# EAGLE design MIC2260x_Module_Electrolytic (EAGLE 9.6.2)
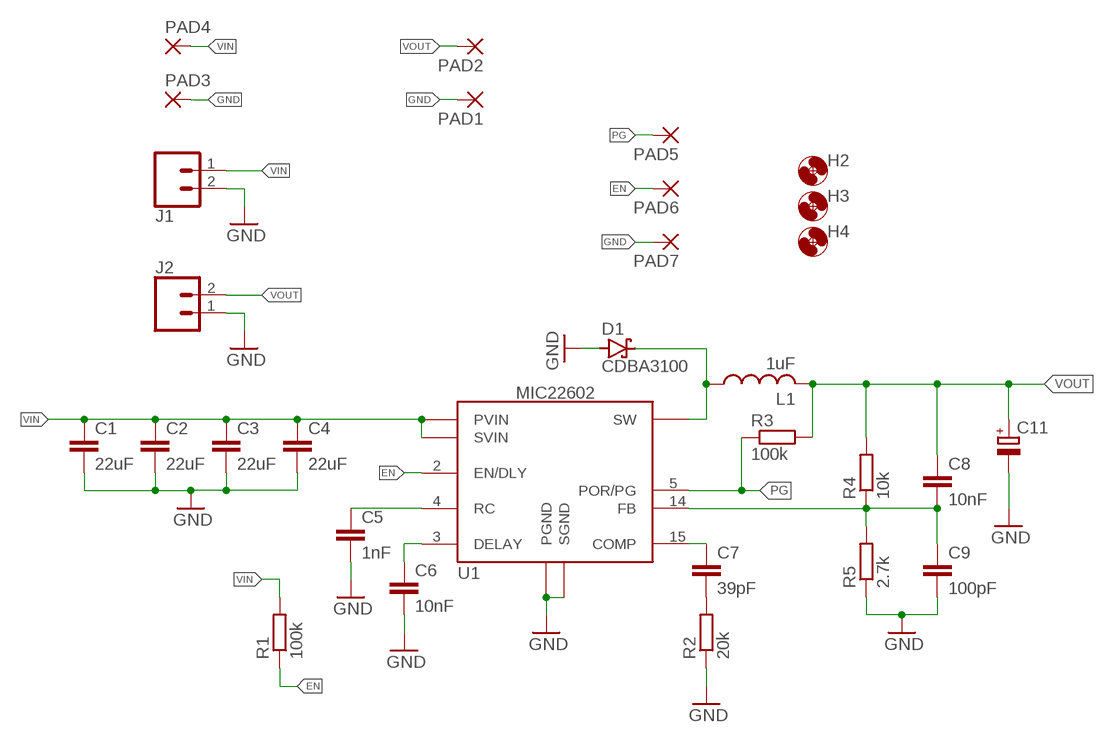
[diagram p0: schematic, sheet 1]

## Parts
C1  22uF  C-EU22UFC0805  [C0805]
C2  22uF  C-EU22UFC0805  [C0805]
C3  22uF  C-EU22UFC0805  [C0805]
C4  22uF  C-EU22UFC0805  [C0805]
C5  1nF  C-EUC0402  [C0402]
C6  10nF  C-EUC0402  [C0402]
C7  39pF  C-EUC0402  [C0402]
C8  10nF  C-EUC0402  [C0402]
C9  100pF  C-EUC0402  [C0402]
C11  CPOL-EUUD-6,3X7,7  [UD-6,3X7,7_NICHICON]
D1  CDBA3100  DIODE_SCHOTTKYDO-214AC  [DO214AC]
H2  MOUNTING_HOLE4_NP  [4_40]
H3  MOUNTING_HOLE4_NP  [4_40]
H4  MOUNTING_HOLE4_NP  [4_40]
J1  CONN_023.5MM_ROUND_RESTRICT  [SCREWTERMINAL-3.5MM-2_ROUND_RESTRICT]
J2  CONN_023.5MM_ROUND_RESTRICT  [SCREWTERMINAL-3.5MM-2_ROUND_RESTRICT]
L1  1uF  INDUCTOR_MAIA_4.1X4.1  [WE-MAIA(4.1X4.1)]
PAD1  SMD5  [SMD2,54-5,08]
PAD2  SMD5  [SMD2,54-5,08]
PAD3  SMD5  [SMD2,54-5,08]
PAD4  SMD5  [SMD2,54-5,08]
PAD5  SMD2  [SMD1,27-2,54]
PAD6  SMD2  [SMD1,27-2,54]
PAD7  SMD2  [SMD1,27-2,54]
R1  100k  R-EU_100KR0402  [R0402]
R2  20k  R-EU_R0402  [R0402]
R3  100k  R-EU_100KR0402  [R0402]
R4  10k  R-EU_10KR0402  [R0402]
R5  2.7k  R-EU_R0402  [R0402]
U1  MIC22602  [QFN24_POWER]

## Nets
COMP: C7.1 U1.15(COMP)
DELAY: C6.1 U1.3(DELAY)
EN: PAD6.1(P) R1.1 U1.2(EN/DLY)
FB: C8.2 C9.1 R4.1 R5.2 U1.14(FB)
GND: C1.2 C2.2 C3.2 C4.2 C5.2 C6.2 C9.2 C11.- D1.A J1.2 J2.1 PAD1.1(P) PAD3.1(P) PAD7.1(P) R2.1 R5.1 U1.7(PGND) U1.12(PGND) U1.16(SGND) U1.19(PGND) U1.24(PGND) U1.EP(PGND) U1.EP@1(PGND) U1.EP@2(PGND) U1.EP@3(PGND) U1.EP@4(PGND) U1.EP@5(PGND) U1.EP@6(PGND) U1.EP@7(PGND) U1.EP@8(PGND) U1.EP@9(PGND)
N$34: C7.2 R2.2
PG: PAD5.1(P) R3.1 U1.5(POR/PG)
RC: C5.1 U1.4(RC)
SW: D1.C L1.P$1 U1.8(SW) U1.9(SW) U1.10(SW) U1.11(SW) U1.20(SW) U1.21(SW) U1.22(SW) U1.23(SW)
VIN: C1.1 C2.1 C3.1 C4.1 J1.1 PAD4.1(P) R1.2 U1.1(PVIN) U1.6(PVIN) U1.13(PVIN) U1.17(SVIN) U1.18(PVIN)
VOUT: C8.1 C11.+ J2.2 L1.P$2 PAD2.1(P) R3.2 R4.2

## Library data of the parts
C1-C4 = bschulz_passives:C-EU: CAPACITOR, European symbol; DIGIKEY: 490-9952-1-ND; MF: Murata; MPN: GRM219R61C226ME15L
C5-C9 = bschulz_passives:C-EU: CAPACITOR, European symbol
C11 = bschulz_passives:CPOL-EU: POLARIZED CAPACITOR, European symbol; SPICEPREFIX: C
D1 = bschulz:DIODE_SCHOTTKY: Generic Shottky Diode
H2-H4 = bschulz:MOUNTING_HOLE: Genaric Mechanical Mounting Hole Hole diameter based on max body diameter + 15% Keepout ring is for diameter of socket cap screw (minimum required clearance) TPlace ring is for diameter of pan head screw (recomended clearance) Specifications: Socket Cap <http://fastener-express.com/fastener-technical/SocketscapSS-Alloy.pdf> Button Head Socket Cap <http://fastener-express.com/fastener-technical/Button-Socket-alloy.pdf> Pan Head <http://fastener-express.com/fastener-technical/pan-machine-Screws.pdf>; DIGIKEY: DNP; MF: N/A; MPN: DNP
J1 J2 = bschulz:CONN_02: Genaric 2 terminal header SCREW_2.54 <https://www.digikey.com/product-detail/en/on-shore-technology-inc/OSTVN02A150/ED10561-ND/1588862> 39532_RA <https://www.digikey.com/product-detail/en/molex/0395321002/WM7845-ND/1280696>; DIGIKEY: ED2635-ND; MF: On Shore; MPN: OSTTE020161
L1 = bschulz:INDUCTOR: Genaric Inductor
PAD1-PAD4 = wirepad:SMD5: SMD PAD
PAD5-PAD7 = bschulz:SMD2: SMD PAD; DIGIKEY: N/A; MF: N/A; MPN: DNP
R1 R3 = bschulz_passives:R-EU_: RESISTOR, European symbol Digikey Parts: Yageo, 0402 <https://www.digikey.com/products/en/resistors/chip-resistor-surface-mount/52?k=&pkeyword=&sv=0&s=4356&sf=1&FV=-1%7C13%2C7%7C2%2C1291%7C39157%2C1989%7C0%2C-8%7C52%2C3%7C1131%2C3%7C2503&quantity=&ColumnSort=0&page=1&stock=1&pageSize=25> Yageo, 0603 <https://www.digikey.com/products/en/resistors/chip-resistor-surface-mount/52?k=&pkeyword=&sv=0&pv1291=39245&sf=1&FV=-5%7C4356%2C-5%7C47360%2C-8%7C52%2C-1%7C13%2C7%7C2%2C1989%7C0&quantity=10&ColumnSort=1000011&page=1&stock=1&pageSize=25> Panasonic, 0603 <https://www.digikey.com/products/en/resistors/chip-resistor-surface-mount/52?k=&pkeyword=&pv252=68&sf=0&FV=ffec373d%2C1c0002%2C142c040c%2C1f140000%2Cffe00034%2C80002%2Cc0001&quantity=&ColumnSort=0&page=1&stock=1&pageSize=25> Panasonic, precision, 0603 <https://www.digikey.com/products/en/resistors/chip-resistor-surface-mount/52?FV=ffec4907%2Cfffc000a%2Cc0172%2C142c040c%2C1f140000%2Cffe00034%2C1c0002&quantity=100&ColumnSort=2085&page=1&stock=1&pageSize=25> Panasonic, 0805 <https://www.digikey.com/products/en/resistors/chip-resistor-surface-mount/52?k=&pkeyword=&pv3=1&sf=0&FV=ffec373d%2C1c0002%2C1f140000%2Cffe00034%2C142c040d&quantity=&ColumnSort=0&page=1&stock=1&pageSize=25> Rohm, current sense <https://www.digikey.com/products/en/resistors/chip-resistor-surface-mount/52?k=&pkeyword=&pv3=1&sf=0&FV=ffecb688%2C1f140000%2Cffe00034%2C1c0002&quantity=&ColumnSort=0&page=1&stock=1&pageSize=25> Vishay, pulse proof automotive <https://www.digikey.com/products/en/resistors/chip-resistor-surface-mount/52?k=&pkeyword=&pv7=2&sf=0&FV=ffec5d6b%2Cffe00034%2C1f140000&quantity=&ColumnSort=0&page=1&stock=1&pageSize=25>; DIGIKEY: 311-100KLRCT-ND; MF: Yageo; MPN: RC0402FR-07100KL; VALUE_PART: 100k
R2 R5 = bschulz_passives:R-EU_: RESISTOR, European symbol Digikey Parts: Yageo, 0402 <https://www.digikey.com/products/en/resistors/chip-resistor-surface-mount/52?k=&pkeyword=&sv=0&s=4356&sf=1&FV=-1%7C13%2C7%7C2%2C1291%7C39157%2C1989%7C0%2C-8%7C52%2C3%7C1131%2C3%7C2503&quantity=&ColumnSort=0&page=1&stock=1&pageSize=25> Yageo, 0603 <https://www.digikey.com/products/en/resistors/chip-resistor-surface-mount/52?k=&pkeyword=&sv=0&pv1291=39245&sf=1&FV=-5%7C4356%2C-5%7C47360%2C-8%7C52%2C-1%7C13%2C7%7C2%2C1989%7C0&quantity=10&ColumnSort=1000011&page=1&stock=1&pageSize=25> Panasonic, 0603 <https://www.digikey.com/products/en/resistors/chip-resistor-surface-mount/52?k=&pkeyword=&pv252=68&sf=0&FV=ffec373d%2C1c0002%2C142c040c%2C1f140000%2Cffe00034%2C80002%2Cc0001&quantity=&ColumnSort=0&page=1&stock=1&pageSize=25> Panasonic, precision, 0603 <https://www.digikey.com/products/en/resistors/chip-resistor-surface-mount/52?FV=ffec4907%2Cfffc000a%2Cc0172%2C142c040c%2C1f140000%2Cffe00034%2C1c0002&quantity=100&ColumnSort=2085&page=1&stock=1&pageSize=25> Panasonic, 0805 <https://www.digikey.com/products/en/resistors/chip-resistor-surface-mount/52?k=&pkeyword=&pv3=1&sf=0&FV=ffec373d%2C1c0002%2C1f140000%2Cffe00034%2C142c040d&quantity=&ColumnSort=0&page=1&stock=1&pageSize=25> Rohm, current sense <https://www.digikey.com/products/en/resistors/chip-resistor-surface-mount/52?k=&pkeyword=&pv3=1&sf=0&FV=ffecb688%2C1f140000%2Cffe00034%2C1c0002&quantity=&ColumnSort=0&page=1&stock=1&pageSize=25> Vishay, pulse proof automotive <https://www.digikey.com/products/en/resistors/chip-resistor-surface-mount/52?k=&pkeyword=&pv7=2&sf=0&FV=ffec5d6b%2Cffe00034%2C1f140000&quantity=&ColumnSort=0&page=1&stock=1&pageSize=25>; MF: Yageo
R4 = bschulz_passives:R-EU_: RESISTOR, European symbol Digikey Parts: Yageo, 0402 <https://www.digikey.com/products/en/resistors/chip-resistor-surface-mount/52?k=&pkeyword=&sv=0&s=4356&sf=1&FV=-1%7C13%2C7%7C2%2C1291%7C39157%2C1989%7C0%2C-8%7C52%2C3%7C1131%2C3%7C2503&quantity=&ColumnSort=0&page=1&stock=1&pageSize=25> Yageo, 0603 <https://www.digikey.com/products/en/resistors/chip-resistor-surface-mount/52?k=&pkeyword=&sv=0&pv1291=39245&sf=1&FV=-5%7C4356%2C-5%7C47360%2C-8%7C52%2C-1%7C13%2C7%7C2%2C1989%7C0&quantity=10&ColumnSort=1000011&page=1&stock=1&pageSize=25> Panasonic, 0603 <https://www.digikey.com/products/en/resistors/chip-resistor-surface-mount/52?k=&pkeyword=&pv252=68&sf=0&FV=ffec373d%2C1c0002%2C142c040c%2C1f140000%2Cffe00034%2C80002%2Cc0001&quantity=&ColumnSort=0&page=1&stock=1&pageSize=25> Panasonic, precision, 0603 <https://www.digikey.com/products/en/resistors/chip-resistor-surface-mount/52?FV=ffec4907%2Cfffc000a%2Cc0172%2C142c040c%2C1f140000%2Cffe00034%2C1c0002&quantity=100&ColumnSort=2085&page=1&stock=1&pageSize=25> Panasonic, 0805 <https://www.digikey.com/products/en/resistors/chip-resistor-surface-mount/52?k=&pkeyword=&pv3=1&sf=0&FV=ffec373d%2C1c0002%2C1f140000%2Cffe00034%2C142c040d&quantity=&ColumnSort=0&page=1&stock=1&pageSize=25> Rohm, current sense <https://www.digikey.com/products/en/resistors/chip-resistor-surface-mount/52?k=&pkeyword=&pv3=1&sf=0&FV=ffecb688%2C1f140000%2Cffe00034%2C1c0002&quantity=&ColumnSort=0&page=1&stock=1&pageSize=25> Vishay, pulse proof automotive <https://www.digikey.com/products/en/resistors/chip-resistor-surface-mount/52?k=&pkeyword=&pv7=2&sf=0&FV=ffec5d6b%2Cffe00034%2C1f140000&quantity=&ColumnSort=0&page=1&stock=1&pageSize=25>; DIGIKEY: 311-10.0KLRCT-ND; MF: Yageo; MPN: RC0402FR-0710KL; VALUE_PART: 10k
U1 = bschulz:MIC2260*: MIC2260x - High Efficiency Synchronous Buck Converter Characteristics: Vin: 2.6V ~ 5.5V Vout: 0.7V ~ Vin Output Current (max): 6A IQ: 850μA (typ) Operating Temperature: -40°C to 85°C Digikey: 576-3645-1-ND <https://www.digikey.com/en/products/detail/microchip-technology/MIC22602YML-TR/2242451>; DIGIKEY: 576-3645-1-ND; DISP: MIC22602; MF: Microchip; MPN: MIC22602YML-TR

## Board
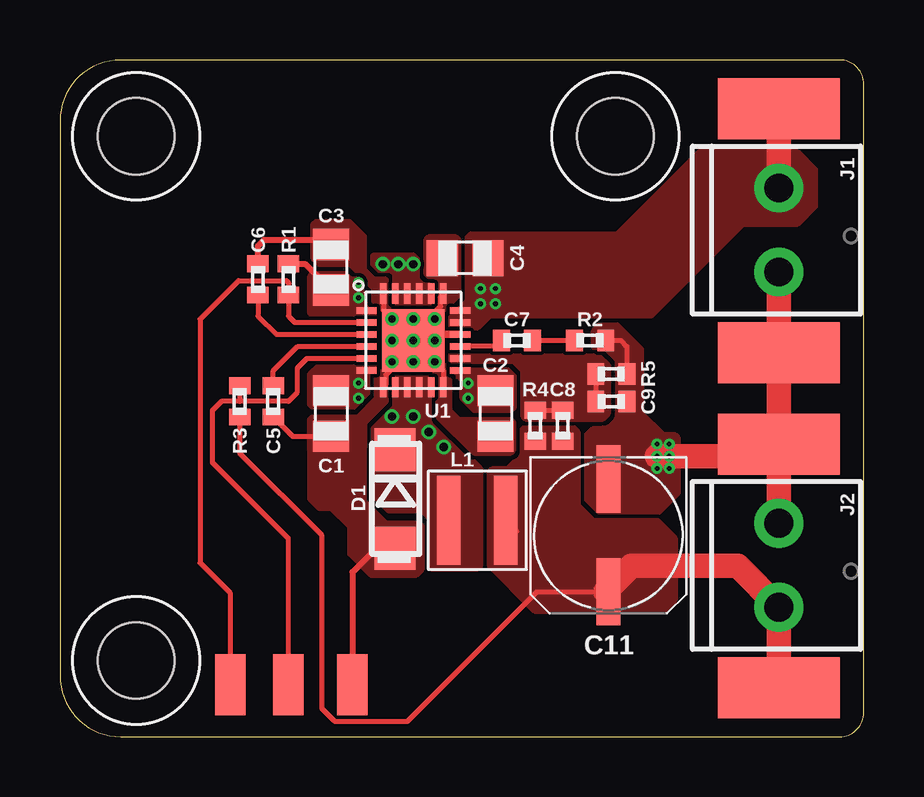
[diagram p1: board, top side]
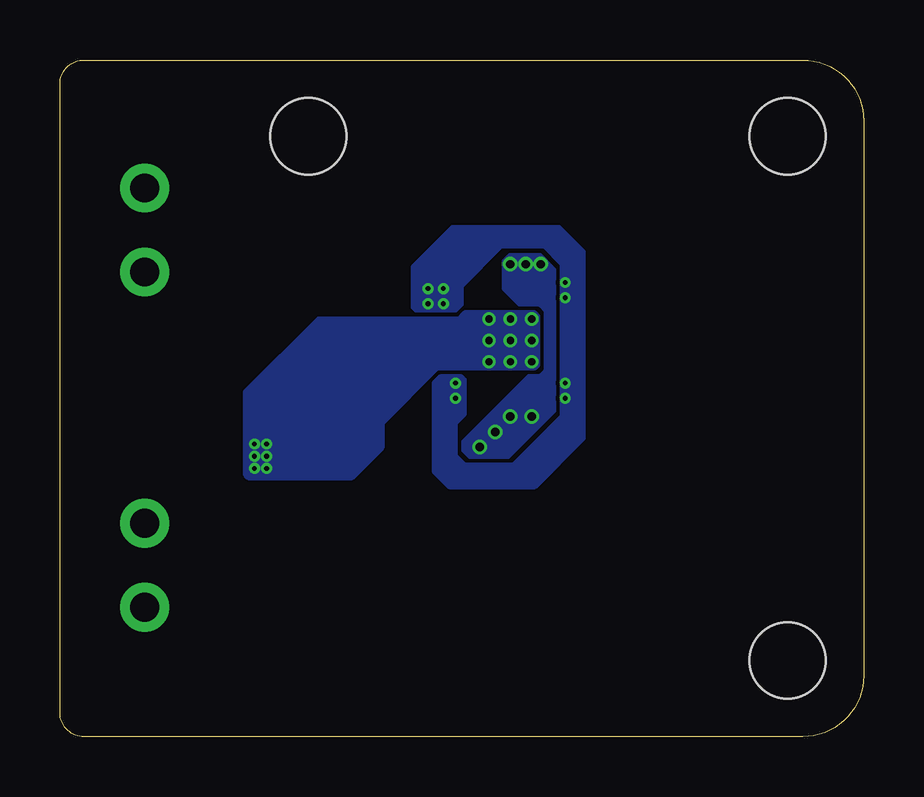
[diagram p2: board, bottom side, seen from below]

Size 33.51 x 28.19 mm. Coordinates in mm from the lower left corner, seen from the top.
Outline: 0,25.65 0,2.54 arc90 2.54,0 32.51,0 arc90 33.51,1 33.51,27.19 arc90 32.51,28.19 2.54,28.19 arc90 0,25.65
Copper layers (1*16): Top 0.035559375mm / dielectric 1.6mm / Bottom 0.035559375mm
Design rules "jlcpcb-2layer": minimum track width 6mil, minimum drill 0.2mm, track to track 6mil, track to pad 6mil, pad to pad 6mil, via to via 6mil, smd to smd 6mil, copper to edge 15mil, drill to drill 6mil, minimum pad ring 5mil, minimum via ring 5mil, stop-mask expansion 2.5mil, vias tented up to drill 0mil, thermal gap 10mil

### Footprints (pad centres in the part's own frame; a part is rotated, then mirrored left to right if it is on the bottom)
C0805 = smd 1.3 x 1.5: 1 -0.95,0; 2 0.95,0
C0402 = smd 0.7 x 0.9: 1 -0.65,0; 2 0.65,0
UD-6,3X7,7_NICHICON = smd 2.8 x 1: + 2.35,0; - -2.35,0
DO214AC = smd 1.8 x 1.7: A 2.05,0; C -2.05,0
4_40 = hole 3.175: 0,0
SCREWTERMINAL-3.5MM-2_ROUND_RESTRICT = drill 1.2 pad 2.032: 1 0,0; 2 3.5,0
WE-MAIA(4.1X4.1) = smd 0.98 x 3.7: P$1 -1.185,0; P$2 1.185,0
SMD2,54-5,08 = smd 2.54 x 5.08: 1 0,0
SMD1,27-2,54 = smd 1.27 x 2.54: 1 0,0
R0402 = smd 0.7 x 0.9: 1 -0.65,0; 2 0.65,0
QFN24_POWER = smd 0.85 x 0.28: 1 -1.95,1.25; 2 -1.95,0.75; 3 -1.95,0.25; 4 -1.95,-0.25; 5 -1.95,-0.75; 6 -1.95,-1.25; 13 1.95,-1.25; 14 1.95,-0.75; 15 1.95,-0.25; 16 1.95,0.25; 17 1.95,0.75; 18 1.95,1.25 | smd 0.28 x 0.85: 7 -1.25,-1.95; 8 -0.75,-1.95; 9 -0.25,-1.95; 10 0.25,-1.95; 11 0.75,-1.95; 12 1.25,-1.95; 19 1.25,1.95; 20 0.75,1.95; 21 0.25,1.95; 22 -0.25,1.95; 23 -0.75,1.95; 24 -1.25,1.95 | smd 2.6 x 2.6: EP 0,0 | drill 0.3: EP@1 -0.889,0.889; EP@2 0,0.889; EP@3 0.889,0.889; EP@4 -0.889,0; EP@5 0,0; EP@6 0.889,0; EP@7 -0.889,-0.889; EP@8 0,-0.889; EP@9 0.889,-0.889

### Placement (x,y rotation side)
C1  11.3,13.46 270 top
C2  18.16,13.46 270 top
C3  11.3,19.56 90 top
C4  16.89,19.94 180 top
C5  8.89,13.97 270 top
C6  8.26,19.05 90 top
C7  19.05,16.51 0 top
C8  20.95,12.95 90 top
C9  22.99,13.97 0 top
C11  22.86,8.38 270 top
D1  13.97,9.91 270 top
H2  3.17,3.17 0 top
H3  3.17,25.02 0 top
H4  23.16,25.02 0 top
J1  29.97,22.86 270 top
J2  29.97,8.89 270 top
L1  17.4,9.02 0 top
PAD1  29.97,16 90 top
PAD2  29.97,2.03 270 top
PAD3  29.97,12.19 270 top
PAD4  29.97,26.16 90 top
PAD5  9.53,2.16 0 top
PAD6  7.11,2.16 0 top
PAD7  12.19,2.16 0 top
R1  9.53,19.05 90 top
R2  22.1,16.51 180 top
R3  7.49,13.97 270 top
R4  19.81,12.95 270 top
R5  22.99,15.11 180 top
U1  14.73,16.51 0 top

### Tracks (layer width: path | path; a pad name or v marks a point on that pad's centre or on a via)
COMP
  Top 0.2: C7.1 18.15,16.26 U1.15
DELAY
  Top 0.2: C6.1 8.26,17.53 9.02,16.76 U1.3
EN
  Top 0.2: U1.2 9.79,17.26 9.53,17.53 R1.1 9.53,18.92 9.45,19 7.45,19 5.84,17.4 5.84,7.24 7.11,5.97 PAD6.1
FB
  Top 0.2: R5.2 C9.1 | R4.1 C8.2
  pour Top (no thermals): 16.26,15.88 22.48,15.88 22.86,15.49 22.86,13.46 22.61,13.21 19.43,13.21 19.3,13.34 19.3,15.24 18.92,15.62 16.38,15.62 16.26,15.75
GND  (via drill 0.2)
  Top 0.2: C5.2 9.7,12.51 C1.2 | R2.1 23.38,16.51 23.64,16.26 R5.1 | U1.EP@5 U1.EP@8 | U1.EP@5 U1.EP@9 | U1.EP@5 U1.EP@4 | U1.EP@5 U1.EP@2 | U1.EP@5 U1.EP@3 | U1.24 13.48,17.76 U1.EP@1 | U1.19 15.87,18.35 15.87,17.93 14.73,16.79 U1.EP@5 | U1.7 13.59,14.67 13.59,15.09 14.73,16.23 U1.EP@5 | U1.EP@5 15.98,15.26 U1.12
  Top 0.254: C6.2 8.26,20.45 8.51,20.7 11.11,20.7 C3.2 | PAD7.1 12.19,6.86 13.19,7.86 D1.A
  Top 0.305: U1.16 14.98,16.76 U1.EP@5
  Top 1.016: PAD3.1 29.46,11.68 v24.89,11.68 | J2.1 PAD3.1 | J1.2 PAD1.1 PAD3.1
  other vias: 24.89,12.19 25.4,12.19 25.4,11.68 24.89,11.18 25.4,11.18
  pour Top (no thermals): 10.41,13.21 10.54,13.34 12.45,13.34 13.21,14.1 13.21,14.99 13.46,15.24 13.72,15.24 13.72,14.1 12.7,13.08 12.7,12.06 12.45,11.81 10.54,11.81 10.41,11.94
  pour Top (no thermals): 14.99,8.89 13.59,8.89 12.7,9.78 12.7,12.06 10.54,12.06 10.41,11.94 10.41,9.91 10.79,9.53 11.3,9.53 12.06,8.76 12.06,7.62 12.95,6.73 14.86,6.73 15.11,6.99 15.11,8.76
  pour Top (no thermals): 15.75,14.99 15.75,13.34 17.27,11.81 18.8,11.81 18.92,11.94 18.92,13.08 18.8,13.21 16.64,13.21 16.26,13.59 16.26,14.86 16.13,14.99 16.13,15.37 16,15.49 15.62,15.49 15.62,15.11
  pour Top (no thermals): 10.54,21.34 10.54,19.94 10.79,19.68 12.06,19.68 13.08,18.67 13.08,18.16 13.46,17.78 13.72,17.78 13.72,18.92 13.59,19.05 13.08,19.05 12.7,19.43 12.7,20.83 12.06,21.46 10.67,21.46
  pour Top (no thermals): 15.24,20.7 15.24,19.3 15.37,19.18 15.62,19.18 15.75,19.05 15.75,17.78 15.88,17.65 16.64,18.41 16.64,20.7 16.51,20.83 15.37,20.83
  pour Bottom (no thermals): 13.59,17.53 13.72,17.65 16.64,17.65 16.89,17.4 22.73,17.4 25.78,14.35 25.78,10.92 25.65,10.79 21.34,10.79 20.07,12.06 20.07,13.08 17.78,15.37 13.72,15.37 13.59,15.49
  pour Top (rank 3, no thermals): 22.23,16.26 23.24,15.24 23.24,13.46 22.61,12.83 22.23,12.83 21.84,12.45 21.84,9.78 22.35,9.27 24.89,9.27 25.78,10.16 25.78,12.45 25.65,12.57 25.15,12.57 24.26,13.46 24.26,16.13 23.24,17.14 22.48,17.14 22.23,16.89
N$34
  Top 0.2: C7.2 R2.2
PG
  Top 0.2: U1.5 10.3,15.76 9.91,15.37 9.91,14.35 9.53,13.97 7.49,13.97 | PAD5.1 9.53,8.26 6.35,11.43 6.35,13.59 6.73,13.97 7.49,13.97 | R3.1 7.49,13.97
RC
  Top 0.2: C5.1 8.89,15.24 9.91,16.26 U1.4
SW  (via drill 0.35)
  other vias: 13.84,13.34 14.73,13.34 15.37,12.7 16,12.06 13.46,19.68 14.1,19.68 14.73,19.68
  pour Top (rank 2, no thermals): 13.84,13.84 13.84,14.86 13.97,14.99 15.49,14.99 15.62,14.86 15.62,13.08 17.53,11.18 17.53,7.11 17.4,6.99 15.49,6.99 15.37,7.11 15.37,9.14 15.11,9.4 13.72,9.4 12.95,10.16 12.95,12.95
  pour Top (rank 2, no thermals): 13.84,18.03 13.97,17.91 15.62,17.91 15.75,18.03 15.75,18.92 15.62,19.05 15.24,19.05 14.99,19.3 14.99,19.81 14.73,20.07 13.08,20.07 12.83,19.81 12.83,19.3 12.95,19.18 13.59,19.18 13.84,18.92
  pour Bottom (rank 2, no thermals): 14.73,20.07 13.08,20.07 12.57,19.56 12.57,13.84 14.86,11.56 16.51,11.56 16.76,11.81 16.76,12.19 13.34,15.62 13.34,17.65 13.59,17.91 14.22,17.91 14.99,18.67 14.99,19.81
VIN  (via drill 0.2)
  Top 0.254: R1.2 10.21,19.7 C3.1
  Top 1.016: J1.1 PAD4.1
  other vias: 12.45,14.1 12.45,14.73 17.02,14.73 17.02,14.1 12.45,18.29 12.45,18.92 17.53,18.03 17.53,18.67 18.16,18.67 18.16,18.03
  pour Top (rank 2, no thermals): 16.26,17.91 16.89,18.54 16.89,20.7 17.14,20.95 23.24,20.95 26.67,24.38 30.73,24.38 31.5,23.62 31.5,22.1 30.73,21.34 28.45,21.34 24.64,17.53 17.91,17.53 17.4,17.02 16.38,17.02 16.26,17.14
  pour Top (rank 2, no thermals): 10.41,15.11 10.79,15.49 13.21,15.49 13.34,15.37 13.34,15.11 13.21,14.99 12.95,14.99 12.83,14.86 12.83,13.97 12.57,13.72 10.54,13.72 10.41,13.84
  pour Top (rank 2, no thermals): 16.26,15.37 16.38,15.49 18.67,15.49 19.05,15.11 19.05,13.84 18.8,13.59 17.27,13.59 16.76,14.1 16.76,14.86 16.64,14.99 16.38,14.99 16.26,15.11
  pour Top (rank 2, no thermals): 10.54,19.3 12.19,19.3 12.57,18.92 12.57,18.16 12.7,18.03 13.08,18.03 13.21,17.91 13.21,17.65 13.08,17.53 10.54,17.53 10.41,17.65 10.41,19.18
  pour Bottom (no thermals): 16.76,18.8 15.11,20.45 13.34,20.45 12.57,19.68 12.57,13.34 14.61,11.3 16.64,11.3 17.02,11.68 17.02,13.08 16.64,13.46 16.64,14.86 16.76,14.99 17.65,14.99 17.91,14.73 17.91,11.05 17.27,10.41 13.72,10.41 11.68,12.45 11.68,20.19 12.7,21.21 17.14,21.21 18.8,19.56 18.8,17.91 18.67,17.78 17.02,17.78 16.76,18.03
VOUT
  Top 0.2: R3.2 7.49,11.81 10.92,8.38 10.92,1.17 11.45,0.64 14.48,0.64 19.88,6.03 22.73,6.03 C11.+ | 19.05,8.55 L1.P$2
  Top 1.016: PAD2.1 J2.2 28.25,7.11 23.81,7.11 22.73,6.03
  pour Top (rank 2, no thermals): 18.03,11.18 18.67,11.18 19.05,11.56 19.05,12.57 19.43,12.95 21.34,12.95 21.59,12.7 21.59,9.65 22.23,9.02 24.9,9.02 25.65,8.26 25.65,5.71 25.15,5.21 19.81,5.21 17.91,7.11 17.91,11.05

### Text on the board
tDocu: + | MIC2260x Module / Electrolytic / v0.0 / B. Schulz | Vin | - | Tosche | - | EN | PG | GND | Vout | +